# Altium schematic sheet InputFilter.SchDoc
size A; SheetNumber: 4; SheetTotal: 5
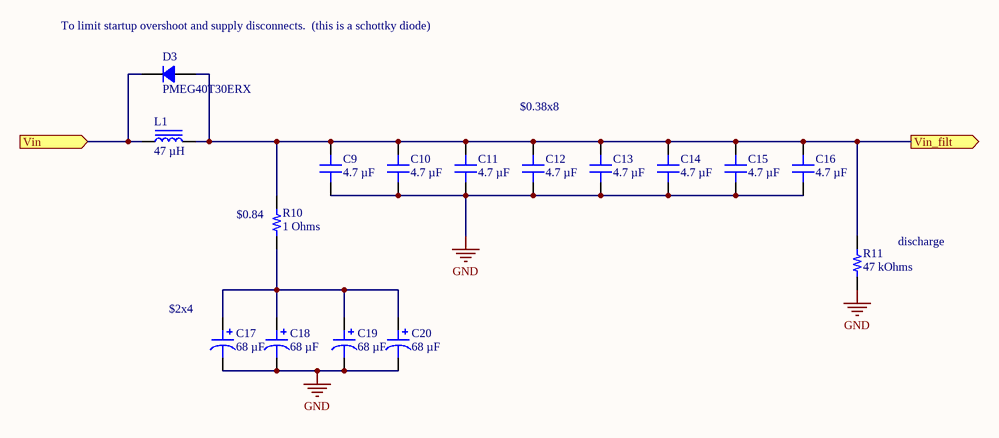
[diagram p0: InputFilter.SchDoc]

## Parts
C9  4.7 µF  [CAP 1206_3216 - 0.8MM]
C10  4.7 µF  [CAP 1206_3216 - 0.8MM]
C11  4.7 µF  [CAP 1206_3216 - 0.8MM]
C12  4.7 µF  [CAP 1206_3216 - 0.8MM]
C13  4.7 µF  [CAP 1206_3216 - 0.8MM]
C14  4.7 µF  [CAP 1206_3216 - 0.8MM]
C15  4.7 µF  [CAP 1206_3216 - 0.8MM]
C16  4.7 µF  [CAP 1206_3216 - 0.8MM]
C17  68 µF  [CAP POL 2917_7343]
C18  68 µF  [CAP POL 2917_7343]
C19  68 µF  [CAP POL 2917_7343]
C20  68 µF  [CAP POL 2917_7343]
D3  PMEG40T30ERX  [SOD-123W]
L1  47 µH  [WURTH WE-HCF 14.5MM]
R10  1 Ohms  [RES 2512_6432]
R11  47 kOhms  [RES 1206_3216]

## Ports
Vin (in), Vin_filt (out)

## Nets
GND: C9.1 C10.1 C11.1 C12.1 C13.1 C14.1 C15.1 C16.1 C17.2 C18.2 C19.2 C20.2 R11.1
Vin: D3.2 L1.2 ; port Vin
Vin_filt: C9.2 C10.2 C11.2 C12.2 C13.2 C14.2 C15.2 C16.2 D3.1 L1.1 R10.2 R11.2 ; port Vin_filt
NetC17_1: C17.1 C18.1 C19.1 C20.1 R10.1

## Notes on the sheet
- (near D3) To limit startup overshoot and supply disconnects.  (this is a schottky diode)
- $0.38x8
- (near R10) $0.84
- (near R11) discharge
- (near C17) $2x4

## Library data of the parts
C9-C16 = C1206C475K5RAC7800: CAP CER 4.7UF 50V X7R 1206; Part Number: C1206C475K5RACTU; manufacturer: KEMET; Tolerance: ±10%; Value: 4.7 µF; Applications: Bypass, Decoupling; Capacitance: 4.7 µF; componentlink1description: Datasheet; componentlink1url: https://api.kemet.com/component-edge/download/datasheet/C1206C475K5RACTU.pdf; componentlink2description: DigiKey Link; componentlink2url: https://www.digikey.com/en/products/detail/kemet/C1206C475K5RAC7800/5119822; Device Package: 1206 (3216 Metric); lastupdated: 7/15/2023 7:14:03 PM; Lifecycle Status: Active; Minimum Order: 1; Mounting Type: Surface Mount, MLCC; Operating Temperature: -55°C ~ 125°C; Package / Case: 1206 (3216 Metric); packaging: TapeAndReel; partid: 38858; Part Status: Active; price: 0.07; series: SMD Comm X7R; Size / Dimension: 0.126" L x 0.063" W (3.20mm x 1.60mm); Supplier 1: DigiKey; Supplier Part Number 1: 399-C1206C475K5RAC7800CT-ND; Temperature Coefficient: X7R; Thickness (Max): 0.071" (1.80mm); Voltage - Rated: 50V
C17-C20 = T491X686K025AT: CAP TANT 68UF 10% 25V 2917; manufacturer: KEMET; Manufacturer Size Code: X; ESR (Equivalent Series Resistance): 700mOhm; Lifetime @ Temp.: 2000 Hrs @ 125°C; Type: Molded; Part Number: T491X686K025AT; Value: 68 µF; Capacitance: 68 µF; componentlink1description: Datasheet; componentlink1url: https://api.kemet.com/component-edge/download/datasheet/T491X686K025AT.pdf; componentlink2description: DigiKey Link; componentlink2url: https://www.digikey.com/en/products/detail/kemet/T491X686K025AT/2336396; Device Package: 2917 (7343 Metric); Features: General Purpose; Height - Seated (Max): 0.169" (4.30mm); lastupdated: 7/13/2023 7:40:28 PM; Lifecycle Status: Active; Minimum Order: 1; Mounting Type: Surface Mount; Operating Temperature: -55°C ~ 125°C; Package / Case: 2917 (7343 Metric); packaging: TapeAndReel; partid: 3138; Part Status: Active; price: 0.74; series: T491; Size / Dimension: 0.287" L x 0.169" W (7.30mm x 4.30mm); Supplier 1: DigiKey; Supplier Part Number 1: 399-8424-1-ND; Tolerance: ±10%; Voltage - Rated: 25 V
D3 = PMEG40T30ERX: DIODE SCHOTTKY 40V 3A SOD123W; Manufacturer: Nexperia USA Inc.; Capacitance @ Vr, F: 560pF @ 1V, 1MHz; Current - Reverse Leakage @ Vr: 28 µA @ 40 V; Reverse Recovery Time (trr): 18 ns; Speed: Fast Recovery =< 500ns, > 200mA (Io); Voltage - Forward (Vf) (Max) @ If: 460 mV @ 3 A; Part Number: PMEG40T30ERX; ComponentLink1Description: Datasheet; ComponentLink1URL: https://assets.nexperia.com/documents/data-sheet/PMEG40T30ER.pdf; ComponentLink2Description: DigiKey Link; ComponentLink2URL: https://www.digikey.com/en/products/detail/nexperia-usa-inc/PMEG40T30ERX/7794686; Current - Average Rectified (Io): 3A; Diode Type: Schottky; LastUpdated: 8/5/2023 9:09:43 PM; Lifecycle Status: Active; Minimum Order: 1; Mounting Type: Surface Mount; Operating Temperature - Junction: 175°C (Max); Package / Case: SOD-123W; Packaging: TapeAndReel; PartId: 3171; Part Status: Active; Price: 0.10; Series: Automotive, AEC-Q101; Supplier 1: DigiKey; Supplier Part Number 1: 1727-7481-1-ND; Supplier Device Package: SOD-123W; Voltage - DC Reverse (Vr) (Max): 40 V
L1 = 7443634700: FIXED IND 47UH 12A 12.2 MOHM SMD; Manufacturer: Würth Elektronik; Current - Saturation: 8.5A; Frequency - Self Resonant: 10MHz; Inductance Frequency - Test: 100 kHz; Material - Core: Manganese Zinc Ferrite (MnZn); Shielding: Shielded; Tolerance: ±15%; Type: Drum Core, Wirewound; Part Number: 7443634700; ComponentLink1Description: Datasheet; ComponentLink1URL: https://katalog.we-online.de/pbs/datasheet/7443634700.pdf; ComponentLink2Description: DigiKey Link; ComponentLink2URL: https://www.digikey.com/en/products/detail/würth-elektronik/7443634700/2440342; Current Rating (Amps): 12 A; DC Resistance (DCR): 12.2mOhm; Device Package: Nonstandard; Height - Seated (Max): 0.571" (14.50mm); Inductance: 47 µH; LastUpdated: 7/12/2023 8:30:57 PM; Lifecycle Status: Active; Minimum Order: 1; Mounting Type: Surface Mount; Operating Temperature: -40°C ~ 125°C; Package / Case: Nonstandard; Packaging: TapeAndReel; PartId: 3230; Part Status: Active; Price: 4.84; Ratings: AEC-Q200; Series: WE-HCF; Size / Dimension: 0.858" L x 0.846" W (21.80mm x 21.50mm); Supplier 1: DigiKey; Supplier Part Number 1: 732-2525-1-ND; Value: 47 µH
R10 = RHC2512FT1R00: RES 1 OHM 1% 2W 2512; Manufacturer: Stackpole Electronics Inc; Temperature Coefficient: ±100ppm/°C; Part Number: RHC2512FT1R00; ComponentLink1Description: Datasheet; ComponentLink1URL: https://www.seielect.com/catalog/sei-rhc.pdf; ComponentLink2Description: DigiKey Link; ComponentLink2URL: https://www.digikey.com/en/products/detail/stackpole-electronics-inc/RHC2512FT1R00/1646034; Composition: Thick Film; Device Package: 2512 (6432 Metric); Features: Moisture Resistant; Height - Seated (Max): 0.028" (0.70mm); LastUpdated: 2/17/2022 6:29:24 PM; Lifecycle Status: Active; Minimum Order: 1; Number of Terminations: 2; Operating Temperature: -55°C ~ 155°C; Package / Case: 2512 (6432 Metric); Packaging: TapeAndReel; Part Status: Active; Power (Watts): 2W; Price: 0.35; Resistance: 1 Ohms; Series: RHC; Size / Dimension: 0.248" L x 0.126" W (6.30mm x 3.20mm); Supplier 1: DigiKey; Supplier Part Number 1: RHC2512FT1R00CT-ND; Supplier Device Package: 2512; Tolerance: ±1%; Value: 1 Ohms
R11 = CRCW120647K0FKEA: RES SMD 47K OHM 1% 1/4W 1206; Manufacturer: Vishay Dale; Power (Watts): 0.25W, 1/4W; Temperature Coefficient: ±100ppm/°C; Part Number: CRCW120647K0FKEA; ComponentLink1Description: Datasheet; ComponentLink1URL: http://www.vishay.com/docs/20035/dcrcwe3.pdf; ComponentLink2Description: DigiKey Link; ComponentLink2URL: https://www.digikey.com/en/products/detail/vishay-dale/CRCW120647K0FKEA/1176834; Composition: Thick Film; Device Package: 1206 (3216 Metric); Features: Automotive AEC-Q200; Height - Seated (Max): 0.024" (0.60mm); LastUpdated: 8/5/2023 7:53:13 PM; Lifecycle Status: Active; Minimum Order: 1; Number of Terminations: 2; Operating Temperature: -55°C ~ 155°C; Package / Case: 1206 (3216 Metric); Packaging: TapeAndReel; PartId: 33069; Part Status: Active; Price: 0.01; Ratings: AEC-Q200; Resistance: 47 kOhms; Series: CRCW; Size / Dimension: 0.126" L x 0.063" W (3.20mm x 1.60mm); Supplier 1: DigiKey; Supplier Part Number 1: 541-47.0KFCT-ND; Supplier Device Package: 1206; Tolerance: ±1%; Value: 47 kOhms